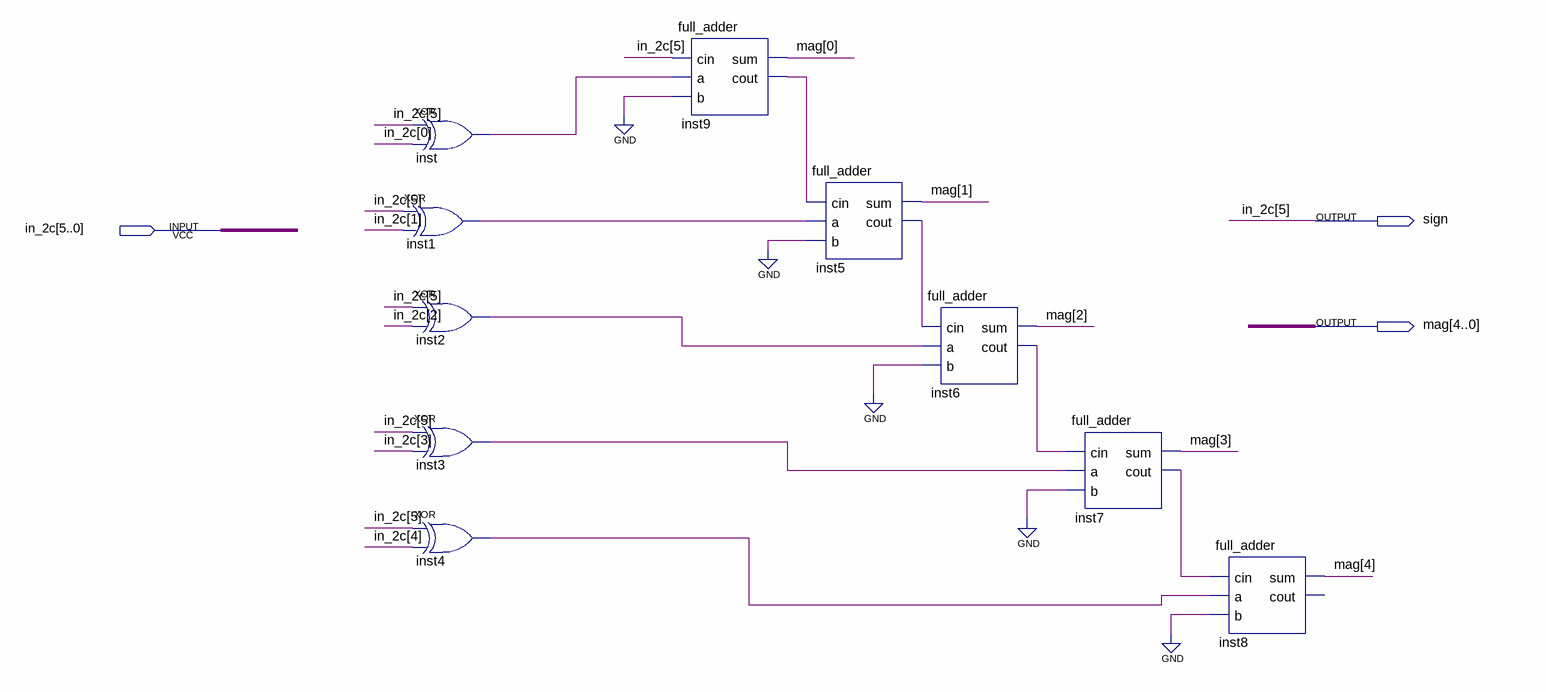
[diagram p0: schematic sheet]
// Quartus schematic c2_to_sm_6bit.bdf as structural Verilog: 10 symbols, 3 pins
module c2_to_sm_6bit (
  input  [5:0] in_2c,
  output sign,
  output [4:0] mag
);

  wire inst1_out, inst2_out, inst3_out, inst4_out, inst5_cout, inst6_cout, inst7_cout, inst9_cout, inst_out;

  xor inst (inst_out, in_2c[5], in_2c[0]);
  xor inst1 (inst1_out, in_2c[5], in_2c[1]);
  xor inst2 (inst2_out, in_2c[5], in_2c[2]);
  xor inst3 (inst3_out, in_2c[5], in_2c[3]);
  xor inst4 (inst4_out, in_2c[5], in_2c[4]);
  full_adder inst9 (.cin(in_2c[5]), .a(inst_out), .b(1'b0), .sum(mag[0]), .cout(inst9_cout));
  full_adder inst5 (.cin(inst9_cout), .a(inst1_out), .b(1'b0), .sum(mag[1]), .cout(inst5_cout));
  full_adder inst6 (.cin(inst5_cout), .a(inst2_out), .b(1'b0), .sum(mag[2]), .cout(inst6_cout));
  full_adder inst7 (.cin(inst6_cout), .a(inst3_out), .b(1'b0), .sum(mag[3]), .cout(inst7_cout));
  full_adder inst8 (.cin(inst7_cout), .a(inst4_out), .b(1'b0), .sum(mag[4]));  // open: cout

  assign sign = in_2c[5];
endmodule
